# Altium schematic sheet TTP223.SchDoc
size A; SheetNumber: 4; SheetTotal: 4
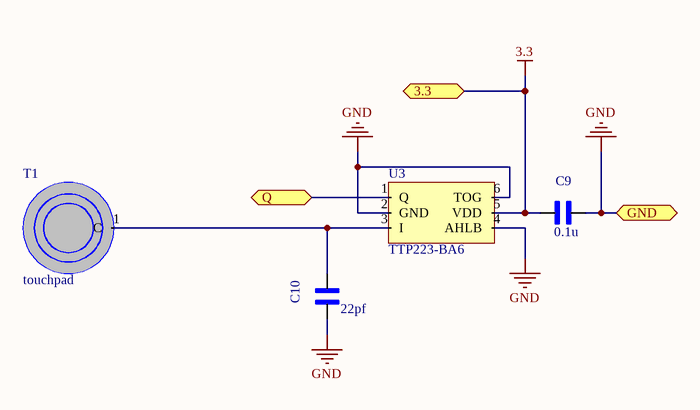
[diagram p0: TTP223.SchDoc]

## Parts
C9  value 0.1u  [*CAPC1608X90]  (hidden comment: GX035C104MAT2-500)
C10  value 22pf  [*CAPC1608X90]  (hidden comment: GX035C104MAT2-500)
T1  touchpad  [TANKSENSOR]
U3  TTP223-BA6  [SOT23-6]

## Ports
3.3 (bidir), GND (bidir), Q (bidir)

## Nets
3.3: C9.2 U3.5(VDD) ; port 3.3
GND: C9.1 C10.2 U3.2(GND) U3.4(AHLB) U3.6(TOG) ; port GND
Q: U3.1(Q) ; port Q
NetC10_1: C10.1 T1.1(C) U3.3(I)

## Library data of the parts
C9 C10 = GX035C104MAT2-500: Cap Thin Film 0.1uf 50v 0603; MF: AVX; MP: GX035C104MAT2-500 or CL10B104JB8NNNC; Pacage Metric: 1608; Type: SMD; Package: 0603 AVX; SnapEDA_Link: https://www.snapeda.com/parts/GX035C104MAT2-500/AVX/view-part/?ref=snap
U3 = TTP223-BA6: HelpURL: https://static.chipdip.ru/lib/928/DOC012928792.pdf; Chipdip_Link: https://www.chipdip.ru/product/ttp223